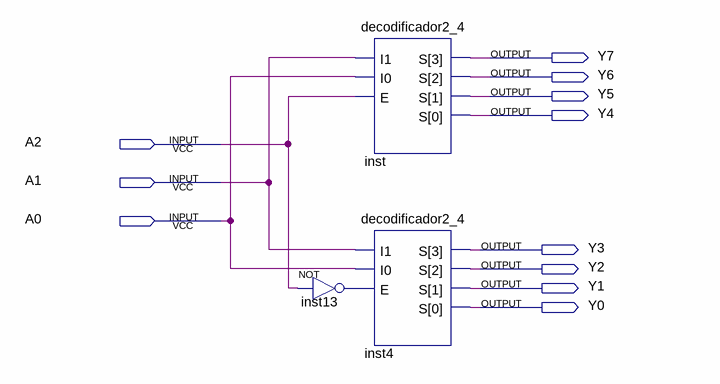
[diagram p0: schematic sheet]
// Quartus schematic decodificador3_8.bdf as structural Verilog: 3 symbols, 11 pins
module decodificador3_8 (
  input  A2,
  input  A1,
  input  A0,
  output Y7,
  output Y6,
  output Y5,
  output Y4,
  output Y3,
  output Y2,
  output Y1,
  output Y0
);

  wire inst13_out;

  decodificador2_4 inst (.I1(A1), .I0(A0), .E(A2), .S({Y7, Y6, Y5, Y4}));
  decodificador2_4 inst4 (.I1(A1), .I0(A0), .E(inst13_out), .S({Y3, Y2, Y1, Y0}));
  not inst13 (inst13_out, A2);
endmodule
